# Altium schematic sheet LCD.SchDoc
size A4; Revision: C.2(PCB.SCH)
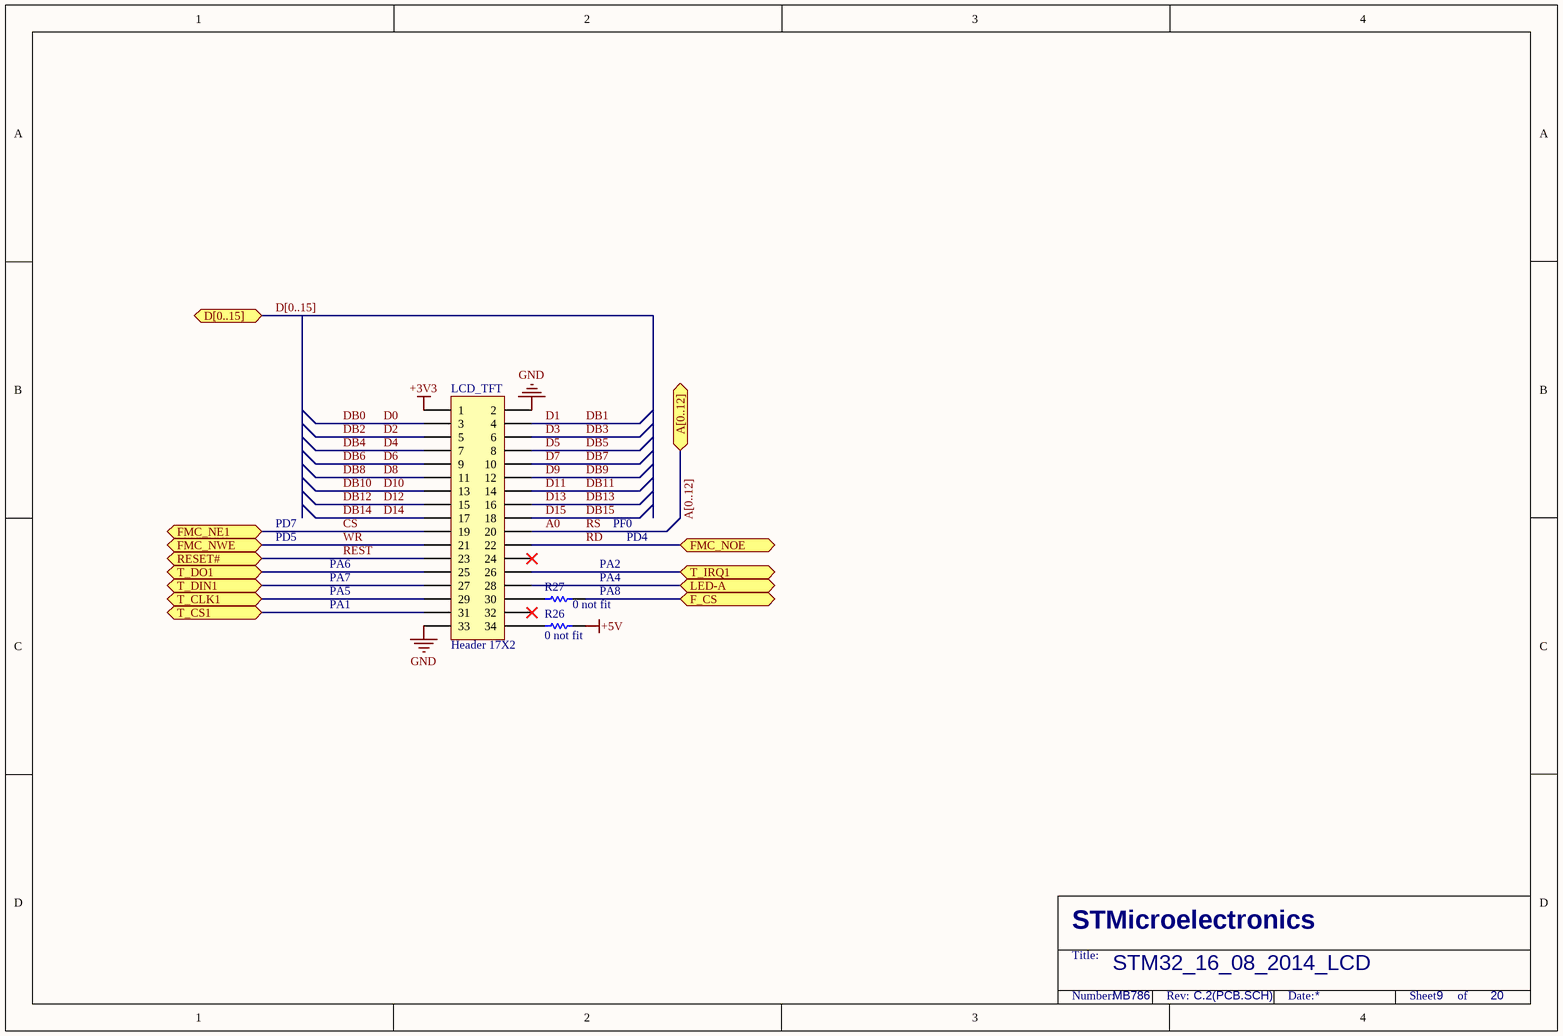
[diagram p0: LCD.SchDoc]

## Parts
LCD_TFT  Header 17X2  [HDR2X17]
R26  0 not fit  [0603_R]
R27  0 not fit  [0603_R]

## Ports
A[0..12], D[0..15], F_CS, FMC_NE1, FMC_NOE, FMC_NWE, LED-A, RESET#, T_CLK1, T_CS1, T_DIN1, T_DO1, T_IRQ1

## Nets
+3V3: LCD_TFT.1
+5V: R26.1
GND: LCD_TFT.2 LCD_TFT.33
A0: LCD_TFT.20  [also labelled RS]
CS: LCD_TFT.19 ; port FMC_NE1
D0: LCD_TFT.3  [also labelled DB0]
D1: LCD_TFT.4  [also labelled DB1]
D2: LCD_TFT.5  [also labelled DB2]
D3: LCD_TFT.6  [also labelled DB3]
D4: LCD_TFT.7  [also labelled DB4]
D5: LCD_TFT.8  [also labelled DB5]
D6: LCD_TFT.9  [also labelled DB6]
D7: LCD_TFT.10  [also labelled DB7]
D8: LCD_TFT.11  [also labelled DB8]
D9: LCD_TFT.12  [also labelled DB9]
D10: LCD_TFT.13  [also labelled DB10]
D11: LCD_TFT.14  [also labelled DB11]
D12: LCD_TFT.15  [also labelled DB12]
D13: LCD_TFT.16  [also labelled DB13]
D14: LCD_TFT.17  [also labelled DB14]
D15: LCD_TFT.18  [also labelled DB15]
F_CS: R27.1 ; port F_CS
LED-A: LCD_TFT.28 ; port LED-A
RD: LCD_TFT.22 ; port FMC_NOE
REST: LCD_TFT.23 ; port RESET#
T_CLK1: LCD_TFT.29 ; port T_CLK1
T_CS1: LCD_TFT.31 ; port T_CS1
T_DIN1: LCD_TFT.27 ; port T_DIN1
T_DO1: LCD_TFT.25 ; port T_DO1
T_IRQ1: LCD_TFT.26 ; port T_IRQ1
WR: LCD_TFT.21 ; port FMC_NWE
NetLCD_TFT_30: LCD_TFT.30 R27.2
NetLCD_TFT_34: LCD_TFT.34 R26.2

Not connected (* = marked no-connect by the designer): LCD_TFT 24* 32*

## Buses and harness runs
bus A[0..12] = port A[0..12]
bus D[0..15] = port D[0..15]

## Notes on the sheet
- PD7
- PD5
- PA6
- PA7
- PA2
- PA4
- PF0
- PD4
- PA5
- PA1
- PA8
- STM32_16_08_2014_LCD
- MB786
- 9
- 20
- STMicroelectronics
- Title:
- Number:
- Rev:
- Date:
- Sheet       of

## Library data of the parts
LCD_TFT = Header 17X2: Header, 17-Pin, Dual row; LatestRevisionDate: 17-Jul-2002; LatestRevisionNote: Re-released for DXP Platform.; Publisher: Altium Limited
R26 R27 = Res1: Resistor; Value: 1K; Published: 8-Jun-2000; LatestRevisionDate: 17-Jul-2002; LatestRevisionNote: Re-released for DXP Platform.; PackageReference: AXIAL-0.3; Publisher: Altium Limited; PackageDescription: Axial Device, Thru-Hole; 2 Leads; 0.3 in Pin Spacing